# Altium schematic sheet Buzzer.SchDoc
size A; SheetNumber: 11
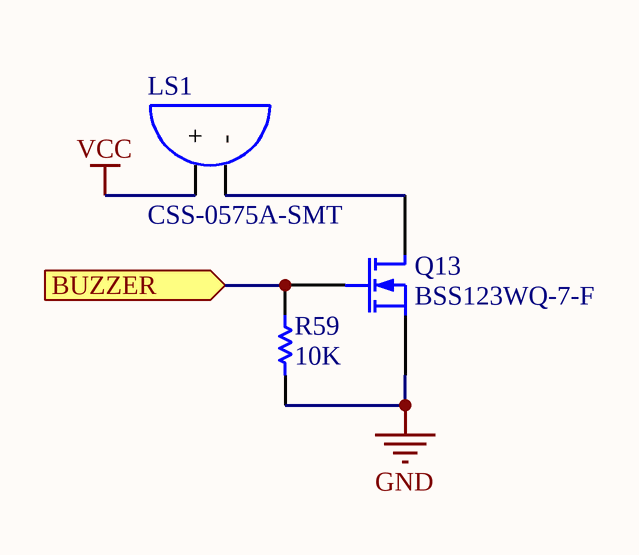
[diagram p0: Buzzer.SchDoc]

## Parts
LS1  CSS-0575A-SMT  [CSS-0575A-SMT]
Q13  BSS123WQ-7-F  [SOT323-3]
R59  value 10K  [R0603[1608]]  (hidden comment: 10K 1% 0603)

## Ports
BUZZER (in)

## Nets
GND: Q13.2(S) R59.1
VCC: LS1.1(+)
BUZZER: Q13.1(G) R59.2 ; port BUZZER
NetLS1_2: LS1.2(-) Q13.3(D)

## Library data of the parts
LS1 = CSS-0575A-SMT: Magnetic Buzzer Transducer; Manufacturer: CUI, Inc.; PartNumber: CSS-0575A-SMT; Mounting Technology: Surface Mount; PackageReference: 5x5x1.9mm
Q13 = BSS123WQ-7-F: N-Channel MOSFET; Manufacturer: Diodes Incorporated; PackageReference: SOT-323-3; PartNumber: BSS123WQ-7-F; Mounting Technology: Surface Mount
R59 = RES_10K_0603_1%: 10K 0.25W 1% 0603 (1005 Metric); Manufacturer: Vishay; PartNumber: RCS060310K0FKEA; Tolerance: 1%; Power: 0.25W; Mounting Technology: Surface Mount; PackageReference: 0603; PackageDescription: 0603 (1608 Metric); ComponentLink1Description: Datasheet; ComponentLink1URL: http://www.vishay.com/docs/20065/rcse3.pdf